# EAGLE design GPSPassive (EAGLE 7.4.0)
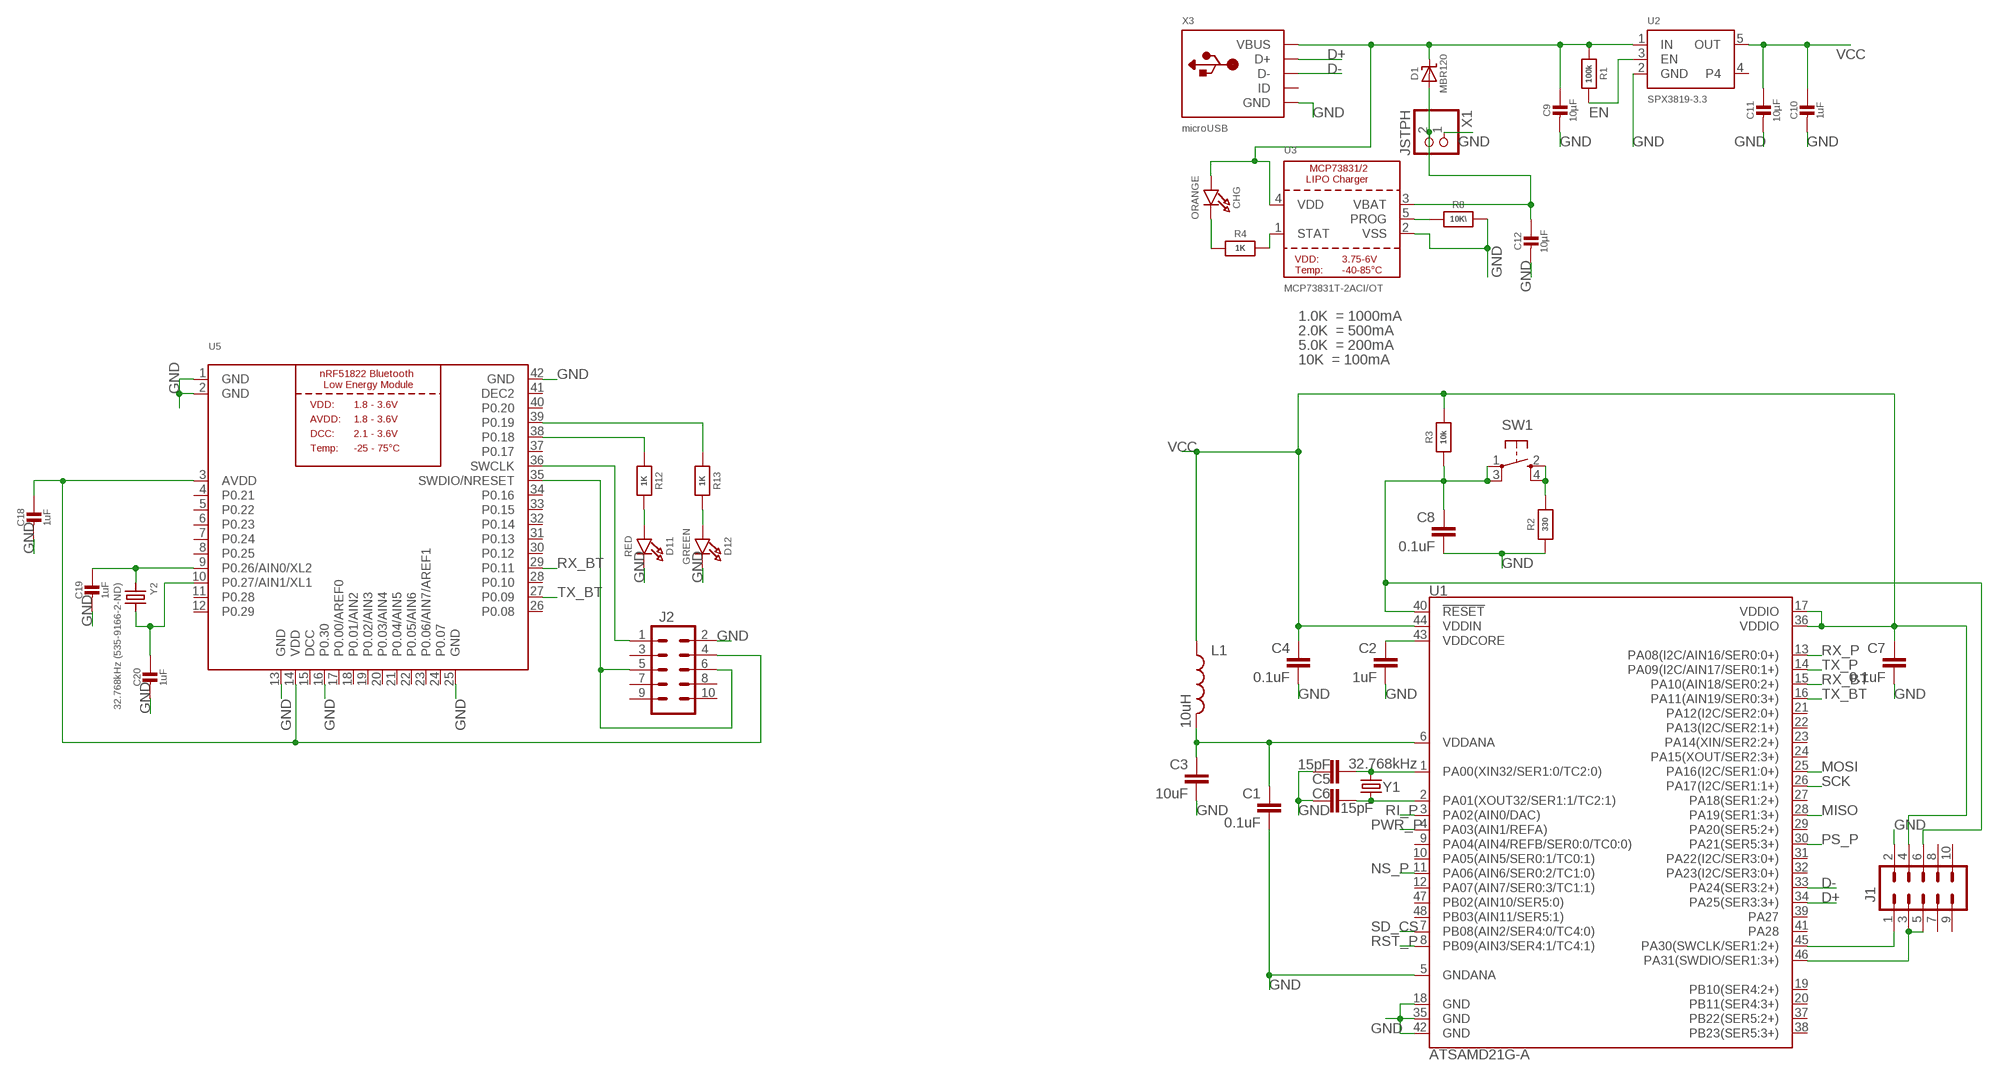
[diagram p0: schematic, sheet 1, part 1 of 2]
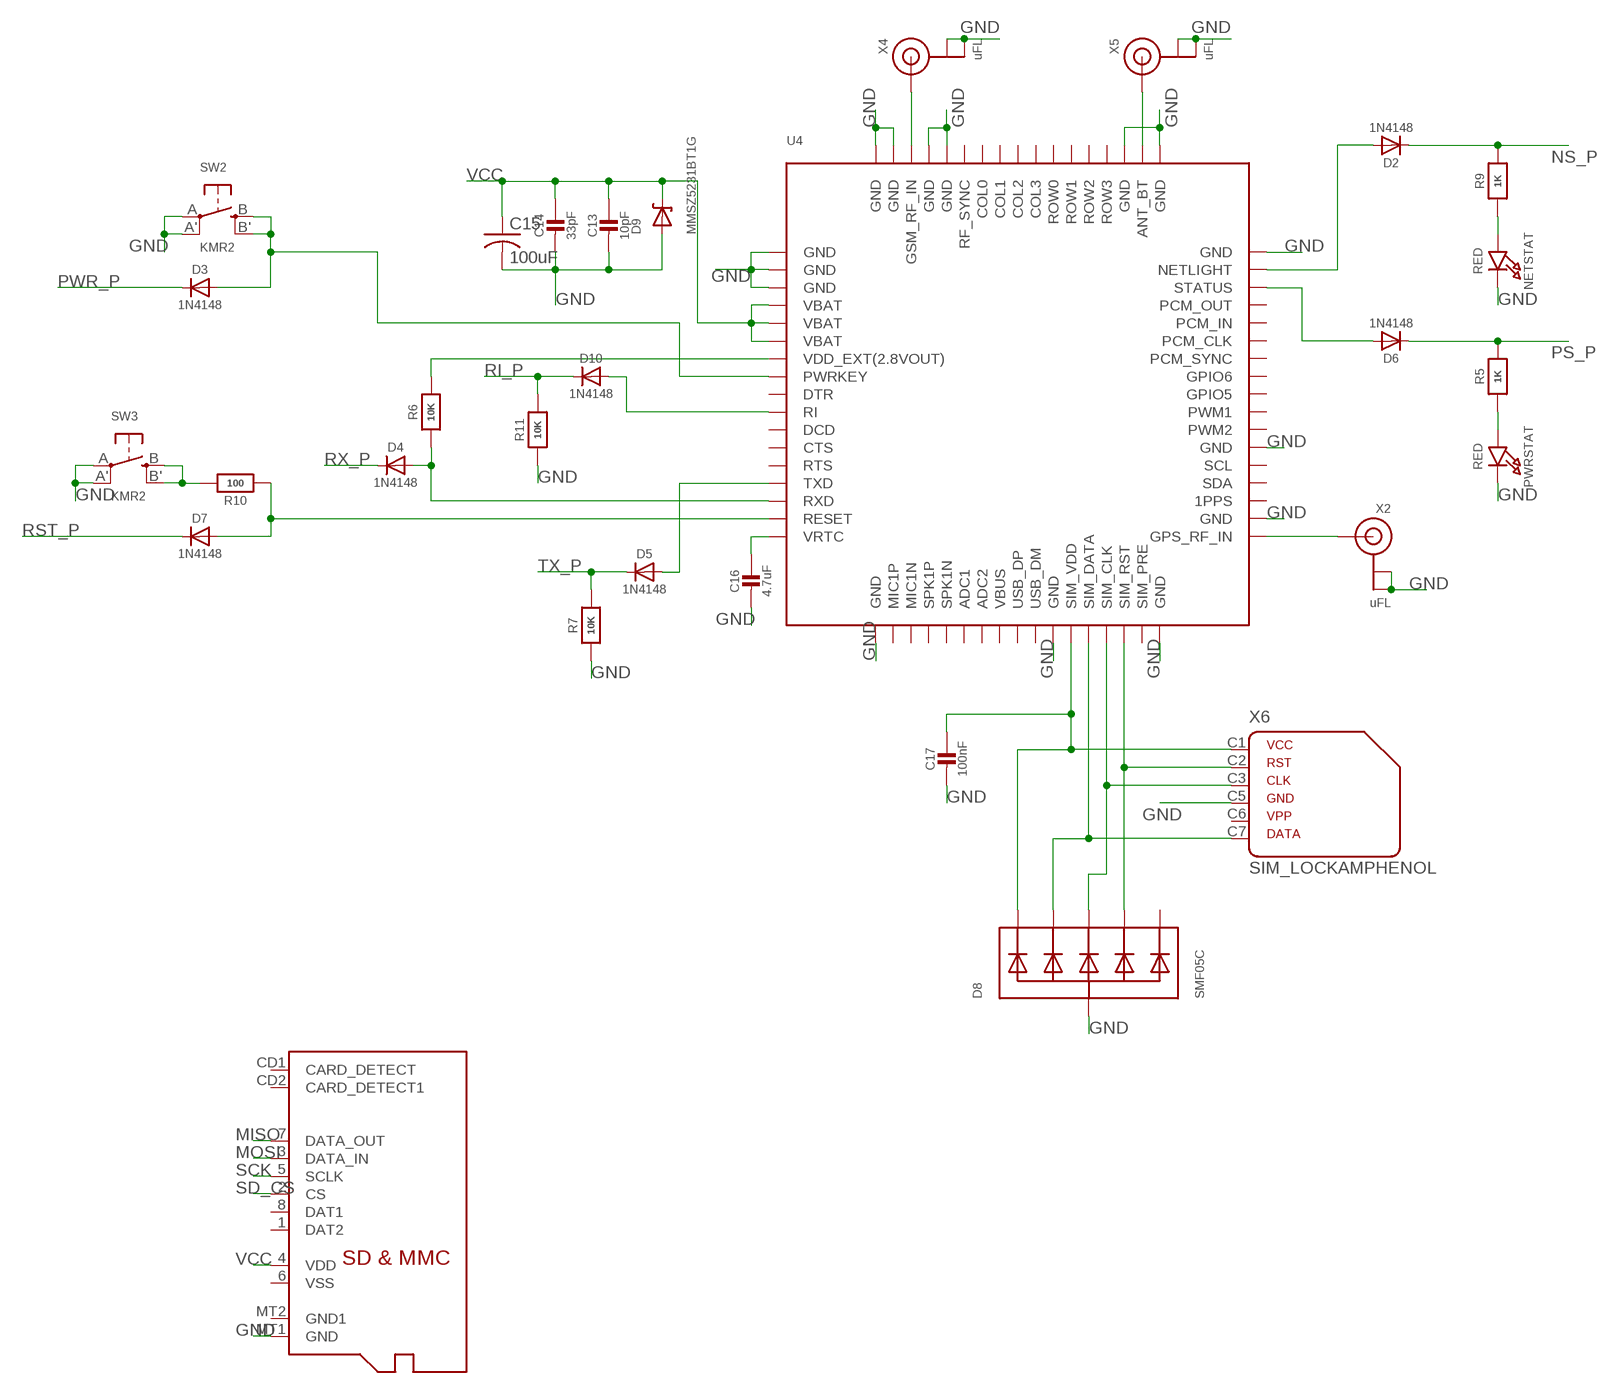
[diagram p1: schematic, sheet 1, part 2 of 2]

## Parts
C1  0.1uF  0.1UF-16V(+-10%)(0402)  [0402-CAP]
C2  1uF  0.1UF-16V(+-10%)(0402)  [0402-CAP]
C3  10uF  0.1UF-16V(+-10%)(0402)  [0402-CAP]
C4  0.1uF  0.1UF-16V(+-10%)(0402)  [0402-CAP]
C5  15pF  15PF-50V(+-5%)(0402)  [0402-CAP]
C6  15pF  15PF-50V(+-5%)(0402)  [0402-CAP]
C7  0.1uF  0.1UF-16V(+-10%)(0402)  [0402-CAP]
C8  0.1uF  0.1UF-16V(+-10%)(0402)  [0402-CAP]
C9  10µF  CAP_CERAMIC0805-NOOUTLINE  [0805-NO]
C10  1uF  CAP_CERAMIC0603_NO  [0603-NO]
C11  10µF  CAP_CERAMIC0805-NOOUTLINE  [0805-NO]
C12  10µF  CAP_CERAMIC0805-NOOUTLINE  [0805-NO]
C13  10pF  CAP_CERAMIC0805-NOOUTLINE  [0805-NO]
C14  33pF  CAP_CERAMIC0805-NOOUTLINE  [0805-NO]
C15  100uF  C-USC1210  [C1210]
C16  4.7uF  CAP_CERAMIC0805-NOOUTLINE  [0805-NO]
C17  100nF  CAP_CERAMIC0805-NOOUTLINE  [0805-NO]
C18  1uF  CAP_CERAMIC0805-NOOUTLINE  [0805-NO]
C19  1uF  CAP_CERAMIC0805-NOOUTLINE  [0805-NO]
C20  1uF  CAP_CERAMIC0805-NOOUTLINE  [0805-NO]
CHG  ORANGE  LED0805_NOOUTLINE  [CHIPLED_0805_NOOUTLINE]
D1  MBR120  DIODE-SCHOTTKYSOD-123  [SOD-123]
D2  1N4148  DIODESOD-323  [SOD-323]
D3  1N4148  DIODESOD-323  [SOD-323]
D4  1N4148  DIODESOD-323  [SOD-323]
D5  1N4148  DIODESOD-323  [SOD-323]
D6  1N4148  DIODESOD-323  [SOD-323]
D7  1N4148  DIODESOD-323  [SOD-323]
D8  SMF05C  TVSARRAY_5LANE  [SOT363]
D9  MMSZ5231BT1G  DIODE-ZENERSOD123  [SOD-123]
D10  1N4148  DIODESOD-323  [SOD-323]
D11  RED  LED0805_NOOUTLINE  [CHIPLED_0805_NOOUTLINE]
D12  GREEN  LED0805_NOOUTLINE  [CHIPLED_0805_NOOUTLINE]
J1  M05X2SHD_LOCK  [2X5-SHROUDED_LOCK]
J2  M05X2SHD_LOCK  [2X5-SHROUDED_LOCK]
L1  10uH  INDUCTOR0603  [0603]
NETSTAT  RED  LED0805_NOOUTLINE  [CHIPLED_0805_NOOUTLINE]
PWRSTAT  RED  LED0805_NOOUTLINE  [CHIPLED_0805_NOOUTLINE]
R1  100k  RESISTOR_0603_NOOUT  [0603-NO]
R2  330  RESISTOR_0603_NOOUT  [0603-NO]
R3  10k  RESISTOR_0603_NOOUT  [0603-NO]
R4  1K  RESISTOR_0603_NOOUT  [0603-NO]
R5  1K  RESISTOR0805_NOOUTLINE  [0805-NO]
R6  10K  RESISTOR0805_NOOUTLINE  [0805-NO]
R7  10K  RESISTOR0805_NOOUTLINE  [0805-NO]
R8  10K\  RESISTOR_0603_NOOUT  [0603-NO]
R9  1K  RESISTOR0805_NOOUTLINE  [0805-NO]
R10  100  RESISTOR0805_NOOUTLINE  [0805-NO]
R11  10K  RESISTOR0805_NOOUTLINE  [0805-NO]
R12  1K  RESISTOR0805_NOOUTLINE  [0805-NO]
R13  1K  RESISTOR0805_NOOUTLINE  [0805-NO]
SW1  SPST_TACT-KMR2  [KMR2]
SW2  KMR2  SWITCH_TACT_SMT4.6X2.8  [BTN_KMR2_4.6X2.8]
SW3  KMR2  SWITCH_TACT_SMT4.6X2.8  [BTN_KMR2_4.6X2.8]
U1  ATSAMD21G-A  [TQFP-48]
U2  SPX3819-3.3  VREG_SOT23-5  [SOT23-5]
U3  MCP73831T-2ACI/OT  MCP73831/2  [SOT23-5]
U4  GSM_SIM808_LITERAL  [SIM900_SMT]
U5  NRF51822_MODULE_MDBT40  [BLE_MODULE_RAYTAC_MDBT40]
U$1  MICROSD  [MICROSD]
X1  JSTPH  CON_JST_PH_2PIN  [JSTPH2]
X2  uFL  ANTENNA_U.FL  [U.FL]
X3  microUSB  USB_MICRO_20329_V2  [4UCONN_20329_V2]
X4  uFL  ANTENNA_U.FL  [U.FL]
X5  uFL  ANTENNA_U.FL  [U.FL]
X6  SIM_LOCKAMPHENOL  [C707_10M006_512_2]
Y1  32.768kHz  CRYSTAL3.2X1.5MM  [CRYSTAL-SMD-3.2X1.5MM]
Y2  32.768kHz (535-9166-2-ND)  CRYSTAL2.0X6.0_32.768  [CRYSTAL_CYL_2X6MM_SMT]

## Nets
!RESET: C8.1 J1.6 R3.1 SW1.1(P) SW1.3(P1) U1.40(!RESET!)
CONNECTED_LED: R13.1 U5.39(P0.19)
D+: U1.34(PA25(SER3:3+)) X3.D+
D-: U1.33(PA24(SER3:2+)) X3.D-
EN: R1.2 U2.3(EN)
GND: C1.2 C2.2 C3.2 C4.2 C5.1 C6.2 C7.2 C8.2 C9.2 C10.2 C11.2 C12.2 C13.2 C14.2 C15.2 C16.2 C17.2 C18.2 C19.2 C20.2 D8.2(A) D9.A D11.C D12.C J1.2 J2.2 NETSTAT.C PWRSTAT.C R2.1 R7.1 R8.2 R11.1 SW2.A'(P1) SW2.A(P) SW3.A'(P1) SW3.A(P) U1.5(GNDANA) U1.18(GND) U1.35(GND) U1.42(GND) U2.2(GND) U3.2(VSS) U4.P$1(GND) U4.P$2(GND) U4.P$3(GND) U4.P$18(GND) U4.P$28(GND) U4.P$34(GND) U4.P$36(GND) U4.P$40(GND) U4.P$51(GND) U4.P$52(GND) U4.P$54(GND) U4.P$64(GND) U4.P$65(GND) U4.P$67(GND) U4.P$68(GND) U5.1(GND) U5.2(GND) U5.13(GND) U5.16(P0.30) U5.25(GND) U5.42(GND) U$1.MT1(GND) X1.1 X2.1(GND) X2.2(GND) X3.BASE@1(GND) X3.BASE@2(GND) X3.GND X3.SPRT@1(GND) X3.SPRT@2(GND) X3.SPRT@3(GND) X3.SPRT@4(GND) X4.1(GND) X4.2(GND) X5.1(GND) X5.2(GND) X6.C5
MISO: U1.28(PA19(SER1:3+)) U$1.7(DATA_OUT)
MODE_LED: R12.1 U5.38(P0.18)
MOSI: U1.25(PA16(I2C/SER1:0+)) U$1.3(DATA_IN)
N$1: C2.1 U1.43(VDDCORE)
N$2: C5.2 U1.1(PA00(XIN32/SER1:0/TC2:0)) Y1.P$2
N$3: J1.1 U1.45(PA30(SWCLK/SER1:2+))
N$4: C6.1 U1.2(PA01(XOUT32/SER1:1/TC2:1)) Y1.P$1
N$5: J1.3 J1.5 U1.46(PA31(SWDIO/SER1:3+))
N$6: C16.1 U4.P$17(VRTC)
N$7: R2.2 SW1.2(S) SW1.4(S1)
N$8: R6.2 U4.P$7(VDD_EXT(2.8VOUT))
N$9: C12.1 D1.A U3.3(VBAT) X1.2
N$10: CHG.C R4.1
N$11: D4.A R6.1 U4.P$15(RXD)
N$12: R4.2 U3.1(STAT)
N$13: R8.1 U3.5(PROG)
N$14: C9.1 CHG.A D1.C R1.1 U2.1(IN) U3.4(VDD) X3.VBUS
N$15: D5.A U4.P$14(TXD)
N$16: D8.5(C4) U4.P$32(SIM_RST) X6.C2
N$17: D8.4(C3) U4.P$31(SIM_CLK) X6.C3
N$18: C17.1 D8.1(C1) U4.P$29(SIM_VDD) X6.C1
N$19: D8.3(C2) U4.P$30(SIM_DATA) X6.C7
N$20: NETSTAT.A R9.1
N$21: PWRSTAT.A R5.1
N$22: U4.P$66(GSM_RF_IN) X4.3(SIGNAL)
N$23: U4.P$35(GPS_RF_IN) X2.3(SIGNAL)
N$24: D10.A U4.P$10(RI)
N$25: U4.P$53(ANT_BT) X5.3(SIGNAL)
N$26: D11.A R12.2
N$27: D12.A R13.2
N$28: C19.1 U5.9(P0.26/AIN0/XL2) Y2.1
N$29: C20.1 U5.10(P0.27/AIN1/XL1) Y2.2
N$30: C18.1 J2.4 U5.3(AVDD) U5.14(VDD)
N$31: J2.1 U5.36(SWCLK)
N$32: J2.5 J2.6 U5.35(SWDIO/NRESET)
NS: D2.A U4.P$50(NETLIGHT)
NS_P: D2.C R9.2 U1.11(PA06(AIN6/SER0:2/TC1:0))
PS: D6.A U4.P$49(STATUS)
PS_P: D6.C R5.2 U1.30(PA21(SER5:3+))
PWR_P: D3.C U1.4(PA03(AIN1/REFA))
PWRKEY: D3.A SW2.B'(S1) SW2.B(S) U4.P$8(PWRKEY)
PWRKEY2: R10.2 SW3.B'(S1) SW3.B(S)
RI_P: D10.C R11.2 U1.3(PA02(AIN0/DAC))
RST: D7.A R10.1 U4.P$16(RESET)
RST_P: D7.C U1.8(PB09(AIN3/SER4:1/TC4:1))
RX_BT: U1.15(PA10(AIN18/SER0:2+)) U5.29(P0.11)
RX_P: D4.C U1.13(PA08(I2C/AIN16/SER0:0+))
SCK: U1.26(PA17(I2C/SER1:1+)) U$1.5(SCLK)
SD_CS: U1.7(PB08(AIN2/SER4:0/TC4:0)) U$1.2(CS)
TX_BT: U1.16(PA11(AIN19/SER0:3+)) U5.27(P0.09)
TX_P: D5.C R7.2 U1.14(PA09(I2C/AIN17/SER0:1+))
VCC: C4.1 C7.1 C10.1 C11.1 C13.1 C14.1 C15.1 D9.C J1.4 L1.1 R3.2 U1.17(VDDIO) U1.36(VDDIO) U1.44(VDDIN) U2.5(OUT) U4.P$4(VBAT) U4.P$5(VBAT) U4.P$6(VBAT) U$1.4(VDD)
VDDANA: C1.1 C3.1 L1.2 U1.6(VDDANA)
Unconnected: D8.6(C5) J1.7 J1.8 J1.9 J1.10 J2.3 J2.7 J2.8 J2.9 J2.10 U1.9(PA04(AIN4/REFB/SER0:0/TC0:0)) U1.10(PA05(AIN5/SER0:1/TC0:1)) U1.12(PA07(AIN7/SER0:3/TC1:1)) U1.19(PB10(SER4:2+)) U1.20(PB11(SER4:3+)) U1.21(PA12(I2C/SER2:0+)) U1.22(PA13(I2C/SER2:1+)) U1.23(PA14(XIN/SER2:2+)) U1.24(PA15(XOUT/SER2:3+)) U1.27(PA18(SER1:2+)) U1.29(PA20(SER5:2+)) U1.31(PA22(I2C/SER3:0+)) U1.32(PA23(I2C/SER3:0+)) U1.37(PB22(SER5:2+)) U1.38(PB23(SER5:3+)) U1.39(PA27) U1.41(PA28) U1.47(PB02(AIN10/SER5:0)) U1.48(PB03(AIN11/SER5:1)) U2.4 U4.P$9(DTR) U4.P$11(DCD) U4.P$12(CTS) U4.P$13(RTS) U4.P$19(MIC1P) U4.P$20(MIC1N) U4.P$21(SPK1P) U4.P$22(SPK1N) U4.P$23(ADC1) U4.P$24(ADC2) U4.P$26(USB_DP) U4.P$27(USB_DM) U4.P$33(SIM_PRE) U4.P$37(1PPS) U4.P$38(SDA) U4.P$39(SCL) U4.P$41(PWM2) U4.P$42(PWM1) U4.P$43(GPIO5) U4.P$44(GPIO6) U4.P$45(PCM_SYNC) U4.P$46(PCM_CLK) U4.P$47(PCM_IN) U4.P$48(PCM_OUT) U4.P$55(ROW3) U4.P$56(ROW2) U4.P$57(ROW1) U4.P$58(ROW0) U4.P$59(COL3) U4.P$60(COL2) U4.P$61(COL1) U4.P$62(COL0) U4.P$63(RF_SYNC) U5.4(P0.21) U5.5(P0.22) U5.6(P0.23) U5.7(P0.24) U5.8(P0.25) U5.11(P0.28) U5.12(P0.29) U5.17(P0.00/AREF0) U5.18(P0.01/AIN2) U5.19(P0.02/AIN3) U5.20(P0.03/AIN4) U5.21(P0.04/AIN5) U5.22(P0.05/AIN6) U5.23(P0.06/AIN7/AREF1) U5.24(P0.07) U5.26(P0.08) U5.28(P0.10) U5.30(P0.12) U5.31(P0.13) U5.32(P0.14) U5.33(P0.15) U5.34(P0.16) U5.37(P0.17) U5.40(P0.20) U$1.1(DAT2) U$1.6(VSS) U$1.8(DAT1) U$1.CD1(CARD_DETECT) U$1.CD2(CARD_DETECT1) U$1.MT2(GND1) X3.ID X6.C6

## Notes on the sheet
- 1.0K  = 1000mA
- 2.0K  = 500mA
- 5.0K  = 200mA
- 10K  = 100mA

## Power pins joined to a net without a drawn wire
DCC: U5.15(DCC)
DEC2: U5.41(DEC2)
VBUS: U4.P$25(VBUS)

## Library data of the parts
C1 C4 C7 C8 = SparkFun-Capacitors:0.1UF-16V(+-10%)(0402); PROD_ID: CAP-12416
C2 C3 = SparkFun-Capacitors:0.1UF-16V(+-10%)(0402); PROD_ID: CAP-12416; VALUE: 0.1uF
C5 C6 = samd21-temp:15PF-50V(+-5%)(0402); PROD_ID: CAP-13063
C9-C14 C16-C20 = microbuilder:CAP_CERAMIC: Ceramic Capacitors For new designs, use the packages preceded by an '_' character since they are more reliable: The following footprints should be used on most boards: _0402 - Standard footprint for regular board layouts _0603 - Standard footprint for regular board layouts _0805 - Standard footprint for regular board layouts _1206 - Standard footprint for regular board layouts For extremely tight-pitch boards where space is at a premium, the following 'micro-pitch' footprints can be used (smaller pads, no silkscreen outline, etc.): _0402MP - Micro-pitch footprint for very dense/compact boards _0603MP - Micro-pitch footprint for very dense/compact boards _0805MP - Micro-pitch footprint for very dense/compact boards _1206MP - Micro-pitch footprint for very dense/compact boards
C15 = rcl:C-US: CAPACITOR, American symbol
CHG D11 D12 NETSTAT PWRSTAT = microbuilder:LED: LED 0603 - 0603 Surface Mount Package 2mA: Green LED - Low Power (3.9mcd, 2ma, 1.7Vf) - Digikey: 475-2709-2-ND Orange LED - Low Power (9.8mcd, 2ma, 1.8Vf) - Digikey: 475-1194-2-ND Red LED - Low Power (5mcd, 2ma, 1.8Vf) - Digikey: 475-1195-2-ND Yellow LED - Low Power (7mcd, 2ma, 1.8Vf) - Digikey: 475-1196-2-ND 5mA: Blue LED - Low Power (17mcd, 5ma, 2.9Vf) - Digikey: LNJ937W8CRACT-ND 0805 - 0805 Surface Mount Package 2mA: Red LED (8.8mcd, 2mA, 1.8Vf, Clear) - Low Power [Digikey: 475-2510-1-ND] Green LED (5mcd, 2mA, 1.8Vf, Clear) - Low Power [Digikey: 475-2730-1-ND] Yellow LED (11.3mcd, 2mA, 1.8Vf, Clear) - Low Power [Digikey: 475-2555-1-ND] 20mA: Red LED (104mcd, 20mA, Diffused) - LS R976 [Digikey: 475-1278-6-ND] Red LED (12mcd, 20mA, 2.0Vf, Clear) - APT2012EC [Digikey: 754-1128-1-ND] Green LED (15mcd, 20mA, 2.2Vf, Clear) - APT2012GC [Digikey: 754-1131-1-ND] Orange LED (160mcd, 20mA, 2.1Vf, Clear) - APT2012SECK [Digikey: 754-1130-1-ND] 1206 - 1206 Surface Mount Package Green LED (26mcd, 20mA, Diffused) - LG N971 [Digikey: 475-1407-6-ND] Red LED (15mcd, 20mA, Diffused) - LH N974 [Digikey: 475-1416-6-ND] Cree - Cree High-Power Surface Mount LEDs XPEBWT-L1-0000-00D50 - White 111lm 350mA 2.9Vf 6200K 110° XTEAWT-00-0000-00000LEE3 - White 114lm 350mA 2.85Vf 5000K 115° Everlight - Everlight 45-21 Series Surface Mount LEDs 45-21/QK2C-B2832AC2CB2/2T - Warm White 2000mcd 20mA 3.25Vf 3050K 120° 45-21/LK2C-B38452C4CB2/2T - Nuetral White 2000mcd 20mA 3.25Vf 4150K 120° 45-21/LK2C-B50634C6CB2/2T - Cold White 2200mcd 20mA 3.25Vf 5650K 120° PLCC2 Reverse Mount LS T77K-J1L2-1-0-2-R18-Z - Red 11.25mcd 2mA 1.8Vf 630nm 120° LO T77K-L1M2-24-Z - Orange 19.6mcd 2mA 1.8Vf 606nm 120° LY T77K-K2M1-26-Z - Yellow 15.7mcd 2mA 1.8Vf 587nm 120°
D1 = microbuilder:DIODE-SCHOTTKY
D2-D7 D10 = microbuilder:DIODE: Diode SMA Model Volts Amps Type Vf Ir Digikey # Notes SSA34-E3 40V 3A Schottky 480mV @ 3A 200uA @ 40V SSA34-E3/61TGITR-ND CDBA120-G 20V 1A Schottky 500mV @ 1A 500uA @ 20V 641-1014-6-ND REEL MBRA210 10V 2A Schottky 350mV @ 2A 700uA @ 10V MBRA210LT3 SOD-123 Model Volts Amps Type Vf Ir Order # Notes BAT54T1G 30V 200mA Schottky 800mV @ 200mA 2uA @ 25V BAT54T1GOSTR-ND B0530W 30V 500mA Schottky 430mV @ 500mA 130uA @ 30V B0530W-FDICT-ND REEL MBR120 20V 1A Schottky 340mV @ 1A MBR120VLSFT1GOSCT-ND SOD-323 Model Volts Amps Type Vf Ir Order # Notes PMEG2005EJ 20V 500mA Schottky 355mV @ 500mA 568-4110-1-ND ZLLS410 10V 570mA Schottky 380mV @ 570mA ZLLS410CT-ND 1N4148WS 75V 150mA Silicon/Simple 1V 1N4148WSFSCT-ND REEL SOD-523 Model Volts Amps Type Vf Ir Order # Notes BAT54XV2 30V 200mA Schottky 0.8V @ 100mA BAT54XV2CT-ND TB751S 30V 30mA Schottky RB751S-40TE61CT-ND SOT23-R/W (R = Solder Paste/Reflow Ovens, W = Hand-Soldering) Model Volts Amps Type Vf Ir Order # Notes BAT54FILM 40V 300mA Schottky 497-7162-1-ND POWERDI-5 Model Volts Amps Type Vf Ir Order # Notes PDS560 60V 5A Schottky 670mV @ 5A 150uA @ 60V PDS560DICT-ND
D8 = microbuilder:TVSARRAY_5LANE: Voltage Transient Suppressor Array SOT363 SMF05C - 100W 5V: Digikey - SMF05CT1GOSCT-ND
D9 = microbuilder:DIODE-ZENER: Zener Diode SMA: 30V 1W Zener Diode, 1.2Vf - Digikey: SMAZ30-FDICT-ND
J1 J2 = SparkFun-Connectors:M05X2: Header 5x2 Standard 10-pin dual row 0.1" header. Commonly used with AVR-ISP. Use with Spark Fun Electronics SKU: PRT-00778
L1 = SparkFun-Passives:INDUCTOR: Inductors Basic Inductor/Choke - 0603 and 1206. Footprints are not proven and vary greatly between part numbers. INDUCTOR POWER 3.3UH 4.0A SMD 0.197" L x 0.197" W x 0.177" H (5.00mm x 5.00mm x 4.50mm); PROD_ID: RES-07859
R1-R13 = microbuilder:RESISTOR: Resistors For new designs, use the packages preceded by an '_' character since they are more reliable: The following footprints should be used on most boards: _0402 - Standard footprint for regular board layouts _0603 - Standard footprint for regular board layouts _0805 - Standard footprint for regular board layouts _1206 - Standard footprint for regular board layouts For extremely tight-pitch boards where space is at a premium, the following 'micro-pitch' footprints can be used (smaller pads, no silkscreen outline, etc.): _0402MP - Micro-pitch footprint for very dense/compact boards _0603MP - Micro-pitch footprint for very dense/compact boards _0805MP - Micro-pitch footprint for very dense/compact boards _1206MP - Micro-pitch footprint for very dense/compact boards
SW1 = adafruit:SPST_TACT: SMT 6mm switch, EVQQ2 series http://www.ladyada.net/library/eagle
SW2 SW3 = microbuilder:SWITCH_TACT_SMT: SMT Tact Switches 6x6mm - Digikey: P12940SCT-ND KMR2 (4.6x2.8mm) - Digikey: 401-1426-1-ND EVQ-PQHB55 - Light Touch, 160GF (4.5x4.5mm) - Digikey: P8090SCT-ND KMT0 - KMT021 NGJ LHS (etc.) IP68/Waterproof - Digikey: CKN10289CT-ND
U1 = SparkFun-DigitalIC:ATSAMD21G: Atmel SAMD21G SMART ARM-Based Microcontroller The Atmel ® | SMART ™ SAM D21 is a series of low-power microcontrollers using the 32-bit ARM ® Cortex ® -M0+ processor, and ranging from 32- to 64-pins with up to 256KB Flash and 32KB of SRAM. The SAM D21 devices operate at a maximum frequency of 48MHz and reach 2.46 CoreMark/MHz. They are designed for simple and intuitive migration with identical peripheral modules, hex compatible code, identical linear address map and pin compatible migration paths between all devices in the product series. All devices include intelligent and flexible peripherals, Atmel Event System for inter-peripheral signaling, and support for capacitive touch button, slider and wheel user interfaces.; PROD_ID: IC-13064
U2 = microbuilder:VREG_SOT23-5: SOT23-5 Fixed Voltage Regulators Part Current Out V Out V In V Dropout θJA (°C/W) TJ (°C) Digikey Part No. ADP121 150mA 3.3V 3.4-5.5V 0.09V @ 150mA -- -- ADP121-AUJZ33R7CT-ND ADP121 150mA 3.0V 3.1-5.5V 0.09V @ 150mA -- -- ADP121-AUJZ30R7CT-ND ADP122 300mA 3.3V 3.4-5.5V 0.085V @ 300mA -- -- ADP122AUJZ-3.3-R7CT-ND ADP1712 300mA 3.3V 3.5-5.5V 0.17V @ 300mA -- -- ADP1712AUJZ-3.3-R7TR-ND AP7311 (Low Cost) 150mA 3.3V 3.5-6V 0.15V @ 150mA -- -- AP7311-33WG-7DICT-ND LD39015M18R 150mA 1.8V 1.9V-5.5V 0.08V @ 100mA -- -- 497-6977-1-ND LP2985A-33DBVR 150mA 3.3V 3.3-16V 0.28V @ 150mA 206 150 296-18479-1-ND MCP1824T-3302E/OT 300mA 3.3V 3.5V-6V 0.2V @ 300mA -- -- MCP1824T-3302E/OTCT-ND MIC5205-2.5YM5 TR 150mA 2.5V 2.7-16V 0.165V @ 150mA -- -- 576-1257-2-ND MIC5205-3.0YM5 TR 150mA 3.0V 3.2V-16V 0.165V @ 150mA -- -- 576-1258-2-ND MIC5205-3.3YM5 TR 150mA 3.3V 3.5V-16V 0.165V @ 150mA -- -- 576-1259-2-ND TPS780330220 150mA 3.3V+2.2V 3.6-5.5V 250mV Max -- -- 296-23332-1-ND TDA3663/N1,135 100mA 3.3V 3.5-45V 0.18V @ 50mA -- -- 568-5343-1-ND Max operating temp can be calculated using θJA, TJ (max junction temperature), and power in watts. Set the "Maximum Ambient Temperature" until it reaches TJ ("Max Junction Temperature"), which is the absolute limit for safe use of the regulator: Heat Sink Temperature Calculator <http://www.daycounter.com/Calculators/Heat-Sink-Temperature-Calculator.phtml> For example, With 12V source into a 3.3V LP2985 and a 30mA load, we are dissipating (12V-3.3V) * 0.03A = 0.261W. With a θJA of 206 °C/W, a TJ of 150°C, and 261mW we can safely use the chip without a heat sink up to 75°C (=147.1°C Junction Temperature).
U3 = microbuilder:MCP73831/2: MCP73831/2 LIPO Charger VDD: 3.75 - 6V Temp -40 - 85°C Programmable Charge Rate: 15-500mA NOTE: STAT is a tri-state logic output on the MCP73831 and an open-drain output on the MCP73832. SOT23-5 with 4.2V output and tri-state logic on STAT = MCP73831T-2ACI/OT
U4 = adafruit:GSM_SIM808_LITERAL: SIM808 GSM Module
U5 = microbuilder:NRF51822_MODULE_MDBT40: nRF51822 Bluetooth Low Energy Module
U$1 = adafruit:MICROSD: Micro-SD / Transflash card holder with SPI pinout For the 3M # 2908-05WB-MG and/or 4UCON #19656 push-push type
X1 = microbuilder:CON_JST_PH_2PIN: JST 2-Pin Right-Angle Connector PH-Series - 4UConnector: 17311 SH-Series - 4UConnector: 07278
X2 X4 X5 = microbuilder:ANTENNA_U.FL: U.FL Antenna Connector
X3 = microbuilder:USB: USB Connectors USBMINIB - Surface Mount Female Mini-B USB Connector 4UConnector: 06564
X6 = microbuilder:SIM_LOCK: C707A SIMLOCK® 2.5 mm with wide solder tails Source: Data sheet <http://www.amphenol.info/downloads/C707_10M006_512_2.pdf>; OC_FARNELL: unknown; OC_NEWARK: unknown
Y1 = samd21-temp:CRYSTAL: Various standard crystals. Proven footprints.; PROD_ID: XTAL-13062
Y2 = microbuilder:CRYSTAL: Crystals HC49UP - Surface Mount Crystal 4.0MHz 18pF +/-30ppm Surface Mount Crystal [Digikey: 535-9857-1-ND] 12.0 MHz Surface Mount Crystal [Digikey: 535-9869-6-ND] 25.0 MHz Surface Mount Crystal [Digikey: 535-9078-1-ND] 2.5 x 2.0mm - MEMs SMT Crystal 16.0 MHz 10pF 20ppm 2.5 x 2.0mm Crystal [Digikey -40-85°C: 535-10923-1-ND] 3.2 x 2.5mm - MEMs SMT Crystal 12.0 MHz 8pF 15ppm 3.2 x 2.5mm Crystal [Digikey: -10-70°C: 644-1047-1-ND -40-125°C: 644-1128-1-ND] 40~85°C cheaper: 644-1173-6-ND 16.0 MHz 8pF 15ppm 3.2 x 2.5mm Crystal [Digikey: -10-70°C: 644-1049-1-ND -40-125°C: 644-1129-2-ND]-40~85°C cheaper: 644-1175-6-ND 16.0 MHz 10pF 10ppm 3.2 x 2.5mm Crystal [Digikey: 644-1100-1-ND] 27.12 MHz 18pF 30ppm 3.2 x 2.5mm Crystal [Digikey: 887-1424-1-ND] 27.12MHz 10pF 10ppm 3.2 x 2.5mm Crystal [Digikey: 887-1329-1-ND] 4.9 x 1.8mm - MEMs SMT Crystal 32.768 KHz 12.5pF 20ppm 4.9 x 1.8mm Crystal [Digikey: SE2415CT-ND] 8.0 x 3.8mm - Surface Mount Crystal 32.768kHz 12.5pF 20ppm -40°C-85°C [Digikey: 535-9166-2-ND] Cylinder 32.768KHz Cylinder Crystal (2x6mm body) [Ex. Digikey: 300-8341-2-ND]

## Board
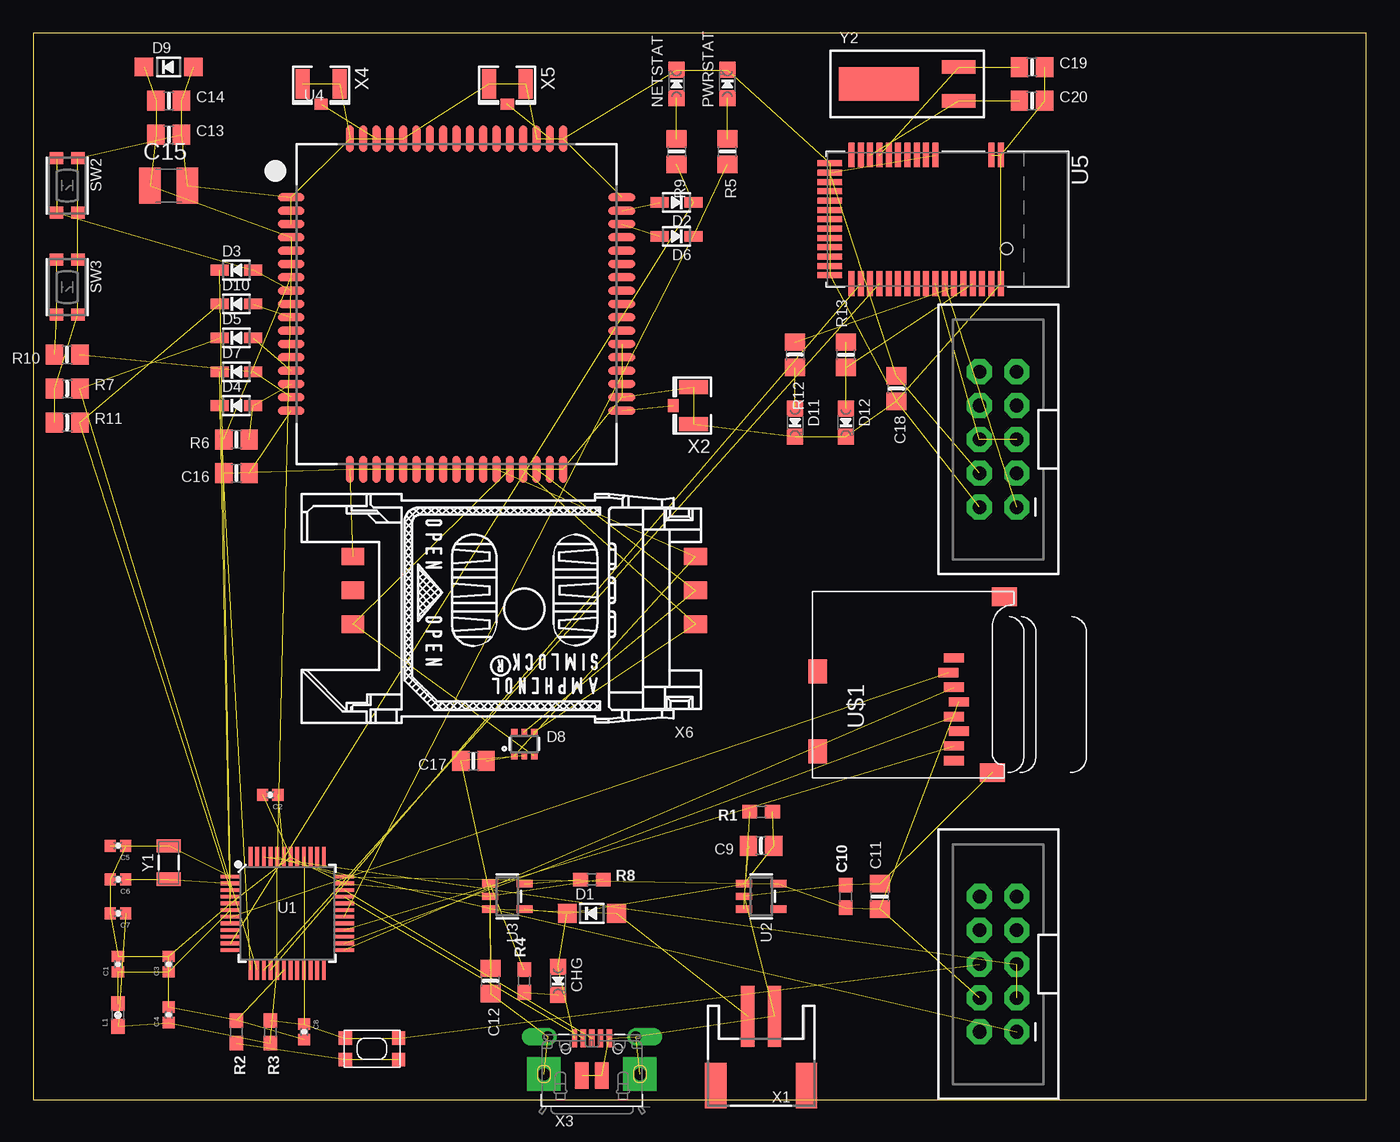
[diagram p2: board, top side]
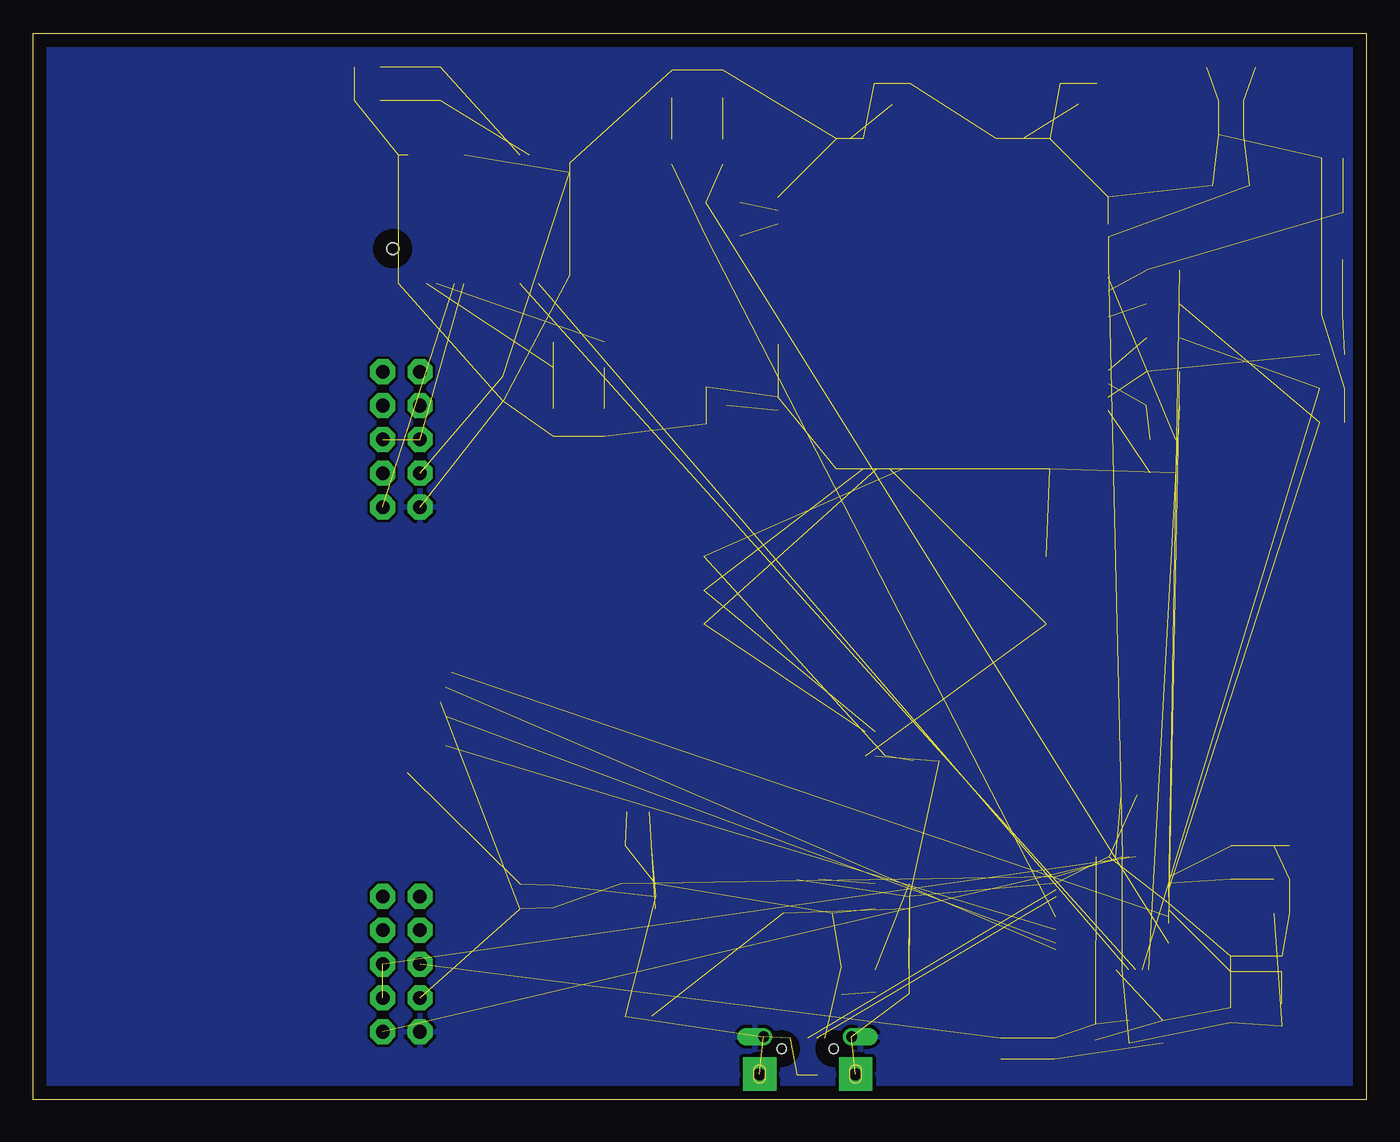
[diagram p3: board, bottom side, seen from below]

Size 100 x 80 mm. Coordinates in mm from the lower left corner, seen from the top.
Outline: 0,0 100,0 100,80 0,80 0,0
Copper layers (1*16): Top 0.035mm / dielectric 1.5mm / Bottom 0.035mm
Design rules "default": minimum track width 10mil, minimum drill 24mil, track to track 8mil, track to pad 8mil, pad to pad 8mil, via to via 8mil, smd to smd 8mil, copper to edge 40mil, drill to drill 8mil, minimum pad ring 10mil, minimum via ring 8mil, stop-mask expansion 4mil, vias tented up to drill 0mil, thermal gap 10mil

### Footprints (pad centres in the part's own frame; a part is rotated, then mirrored left to right if it is on the bottom)
0402-CAP = smd 0.85 x 0.9: 1 -0.58,0; 2 0.58,0
0805-NO = smd 1.3 x 1.5: 1 -0.95,0; 2 0.95,0
0603-NO = smd 1.1 x 1: 1 -0.85,0; 2 0.85,0
C1210 = smd 1.6 x 2.7: 1 -1.4,0; 2 1.4,0
CHIPLED_0805_NOOUTLINE = smd 1.2 x 1.2: A 0,-1.05; C 0,1.05
SOD-123 = smd 1.4 x 1.4: A 1.85,0; C -1.85,0
SOD-323 = smd 1.35 x 0.8: A 1.27,0; C -1.27,0
SOT363 = smd 0.5 x 0.5: 1 -0.75,-0.9; 3 0.75,-0.9; 4 0.75,0.9; 6 -0.75,0.9 | smd 0.4 x 0.5: 2 0,-0.9; 5 0,0.9
2X5-SHROUDED_LOCK = drill 1.016 pad 1.88 octagon: 1 -1.397,5.08; 2 1.397,5.08; 3 -1.397,2.54; 4 1.397,2.54; 5 -1.397,0; 6 1.397,0; 7 -1.397,-2.54; 8 1.397,-2.54; 9 -1.397,-5.08; 10 1.397,-5.08
0603 = smd 1.1 x 1: 1 -0.85,0; 2 0.85,0
KMR2 = smd 1 x 1: 1 2,0.8; 2 2,-0.8; 3 -2,0.8; 4 -2,-0.8
BTN_KMR2_4.6X2.8 = smd 0.9 x 1: A 2.05,0.8; A' -2.05,0.8; B 2.05,-0.8; B' -2.05,-0.8
TQFP-48 = smd 1.5 x 0.28: 1 -4.25,2.75; 2 -4.25,2.25; 3 -4.25,1.75; 4 -4.25,1.25; 5 -4.25,0.75; 6 -4.25,0.25; 7 -4.25,-0.25; 8 -4.25,-0.75; 9 -4.25,-1.25; 10 -4.25,-1.75; 11 -4.25,-2.25; 12 -4.25,-2.75; 25 4.25,-2.75; 26 4.25,-2.25; 27 4.25,-1.75; 28 4.25,-1.25; 29 4.25,-0.75; 30 4.25,-0.25; 31 4.25,0.25; 32 4.25,0.75; 33 4.25,1.25; 34 4.25,1.75; 35 4.25,2.25; 36 4.25,2.75 | smd 0.28 x 1.5: 13 -2.75,-4.25; 14 -2.25,-4.25; 15 -1.75,-4.25; 16 -1.25,-4.25; 17 -0.75,-4.25; 18 -0.25,-4.25; 19 0.25,-4.25; 20 0.75,-4.25; 21 1.25,-4.25; 22 1.75,-4.25; 23 2.25,-4.25; 24 2.75,-4.25; 37 2.75,4.25; 38 2.25,4.25; 39 1.75,4.25; 40 1.25,4.25; 41 0.75,4.25; 42 0.25,4.25; 43 -0.25,4.25; 44 -0.75,4.25; 45 -1.25,4.25; 46 -1.75,4.25; 47 -2.25,4.25; 48 -2.75,4.25
SOT23-5 = smd 0.55 x 1.2: 1 -0.95,-1.3; 2 0,-1.3; 3 0.95,-1.3; 4 0.95,1.3; 5 -0.95,1.3
SIM900_SMT = smd 2 x 0.6: P$1 -12.4,8; P$2 -12.4,7; P$3 -12.4,6; P$4 -12.4,5; P$5 -12.4,4; P$6 -12.4,3; P$7 -12.4,2; P$8 -12.4,1; P$9 -12.4,0; P$10 -12.4,-1; P$11 -12.4,-2; P$12 -12.4,-3; P$13 -12.4,-4; P$14 -12.4,-5; P$15 -12.4,-6; P$16 -12.4,-7; P$17 -12.4,-8; P$35 12.4,-8; P$36 12.4,-7; P$37 12.4,-6; P$38 12.4,-5; P$39 12.4,-4; P$40 12.4,-3; P$41 12.4,-2; P$42 12.4,-1; P$43 12.4,0; P$44 12.4,1; P$45 12.4,2; P$46 12.4,3; P$47 12.4,4; P$48 12.4,5; P$49 12.4,6; P$50 12.4,7; P$51 12.4,8 | smd 0.6 x 2: P$18 -8,-12.4; P$19 -7,-12.4; P$20 -6,-12.4; P$21 -5,-12.4; P$22 -4,-12.4; P$23 -3,-12.4; P$24 -2,-12.4; P$25 -1,-12.4; P$26 0,-12.4; P$27 1,-12.4; P$28 2,-12.4; P$29 3,-12.4; P$30 4,-12.4; P$31 5,-12.4; P$32 6,-12.4; P$33 7,-12.4; P$34 8,-12.4; P$52 8,12.4; P$53 7,12.4; P$54 6,12.4; P$55 5,12.4; P$56 4,12.4; P$57 3,12.4; P$58 2,12.4; P$59 1,12.4; P$60 0,12.4; P$61 -1,12.4; P$62 -2,12.4; P$63 -3,12.4; P$64 -4,12.4; P$65 -5,12.4; P$66 -6,12.4; P$67 -7,12.4; P$68 -8,12.4
BLE_MODULE_RAYTAC_MDBT40 = smd 1.85 x 0.45: 1 -4.825,4; 2 -4.825,3.3; 3 -4.825,-0.9; 4 -4.825,-1.6; 5 -4.825,-2.3; 6 -4.825,-3; 7 -4.825,-3.7; 8 -4.825,-4.4; 9 -4.825,-5.1; 10 -4.825,-5.8; 11 -4.825,-6.5; 12 -4.825,-7.2; 26 4.825,-7.2; 27 4.825,-6.5; 28 4.825,-5.8; 29 4.825,-5.1; 30 4.825,-4.4; 31 4.825,-3.7; 32 4.825,-3; 33 4.825,-2.3; 34 4.825,-1.6; 35 4.825,-0.9; 36 4.825,-0.2; 37 4.825,0.5; 38 4.825,1.2; 39 4.825,1.9; 40 4.825,2.6; 41 4.825,3.3; 42 4.825,4 | smd 0.45 x 1.85: 13 -4.2,-8.825; 14 -3.5,-8.825; 15 -2.8,-8.825; 16 -2.1,-8.825; 17 -1.4,-8.825; 18 -0.7,-8.825; 19 0,-8.825; 20 0.7,-8.825; 21 1.4,-8.825; 22 2.1,-8.825; 23 2.8,-8.825; 24 3.5,-8.825; 25 4.2,-8.825 | hole 0.9: 2.2,4.45
MICROSD = smd 0.7 x 1.5: 1 9,-10.64; 2 7.9,-10.24; 3 6.8,-10.64; 4 5.7,-11.04; 5 4.6,-10.64; 6 3.5,-11.04; 7 2.4,-10.64; 8 1.3,-10.64 | smd 1.8 x 1.4: CD1 2,-0.44; CD2 8,-0.44 | smd 1.4 x 1.9: MT1 0.4,-13.54; MT2 13.6,-14.44
JSTPH2 = smd 1 x 4.6: 1 -1,-3.7; 2 1,-3.7 | smd 1.6 x 3.4: NC1 -3.4,1.5; NC2 3.4,1.5
U.FL = smd 2.2 x 1.05: 1 0,1.375; 2 0,-1.375 | smd 0.8 x 1: 3 1.525,0
4UCONN_20329_V2 = smd 1 x 2: BASE@1 -0.75,-2; BASE@2 0.75,-2 | smd 0.4 x 1.35: D+ 0,0.775; D- -0.65,0.775; GND 1.3,0.775; ID 0.65,0.775; VBUS -1.3,0.775 | drill 0.8 pad 1.2 offset: SPRT@1 -3.3,0.9; SPRT@2 3.3,0.9 | drill 0.9 pad 2.5 square: SPRT@3 -3.6,-1.9; SPRT@4 3.6,-1.9 | hole 0.7: -1.95,0; 1.95,0
C707_10M006_512_2 = smd 1.7 x 1.3: C1 -12.85,-3.915; C2 -12.85,-1.375; C3 -12.85,1.165; C5 12.85,-3.915; C6 12.85,-1.375; C7 12.85,1.165
CRYSTAL-SMD-3.2X1.5MM = smd 1 x 1.8: P$1 -1.25,0; P$2 1.25,0
CRYSTAL_CYL_2X6MM_SMT = smd 2.5 x 1: 1 2.125,1.27; 2 2.125,-1.27 | smd 6 x 2.5: CYLINDER -3.875,0

### Placement (x,y rotation side)
C1  6.35,10.16 90 top
C2  17.78,22.86 180 top
C3  10.16,10.16 90 top
C4  10.16,6.35 90 top
C5  6.35,19.05 180 top
C6  6.35,16.51 180 top
C7  6.35,13.97 180 top
C8  20.32,5.08 270 top
C9  54.61,19.05 180 top
C10  60.96,15.24 90 top
C11  63.5,15.24 90 top
C12  34.29,8.89 270 top
C13  10.16,72.39 0 top
C14  10.16,74.93 0 top
C15  10.16,68.58 0 top
C16  15.24,46.99 180 top
C17  33.02,25.4 180 top
C18  64.77,53.34 270 top
C19  74.93,77.47 0 top
C20  74.93,74.93 0 top
CHG  39.37,8.89 180 top
D1  41.91,13.97 0 top
D2  48.26,67.31 180 top
D3  15.24,62.23 0 top
D4  15.24,52.07 0 top
D5  15.24,57.15 0 top
D6  48.26,64.77 180 top
D7  15.24,54.61 0 top
D8  36.83,26.67 0 top
D9  10.16,77.47 0 top
D10  15.24,59.69 0 top
D11  57.15,50.8 180 top
D12  60.96,50.8 180 top
J1  72.39,10.16 180 top
J2  72.39,49.53 180 top
L1  6.35,6.35 90 top
NETSTAT  48.26,76.2 0 top
PWRSTAT  52.07,76.2 0 top
R1  54.61,21.59 180 top
R2  15.24,5.08 270 top
R3  17.78,5.08 270 top
R4  36.83,8.89 90 top
R5  52.07,71.12 270 top
R6  15.24,49.53 180 top
R7  2.54,53.34 0 top
R8  41.91,16.51 0 top
R9  48.26,71.12 270 top
R10  2.54,55.88 180 top
R11  2.54,50.8 0 top
R12  57.15,55.88 270 top
R13  60.96,55.88 90 top
SW1  25.4,3.81 0 top
SW2  2.54,68.58 270 top
SW3  2.54,60.96 270 top
U1  19.05,13.97 0 top
U2  54.61,15.24 270 top
U3  35.56,15.24 270 top
U4  31.75,59.69 0 top
U5  68.58,66.04 270 top
U$1  58.42,24.13 90 top
X1  54.61,2.54 180 top
X2  49.53,52.07 180 top
X3  41.91,3.81 0 top
X4  21.59,76.2 270 top
X5  35.56,76.2 270 top
X6  36.83,36.83 180 top
Y1  10.16,17.78 90 top
Y2  67.31,76.2 0 top

### Tracks (layer width: path | path; a pad name or v marks a point on that pad's centre or on a via)
!RESET  (5 unrouted)
CONNECTED_LED  (1 unrouted)
D+  (1 unrouted)
D-  (1 unrouted)
EN  (1 unrouted)
GND  (75 unrouted)
  pour Bottom: 0,-1.27 101.6,-1.27 101.6,1.27 101.6,82.55 0,82.55
MISO  (1 unrouted)
MODE_LED  (1 unrouted)
MOSI  (1 unrouted)
N$1  (1 unrouted)
N$2  (2 unrouted)
N$3  (1 unrouted)
N$4  (2 unrouted)
N$5  (2 unrouted)
N$6  (1 unrouted)
N$7  (2 unrouted)
N$8  (1 unrouted)
N$9  (3 unrouted)
N$10  (1 unrouted)
N$11  (2 unrouted)
N$12  (1 unrouted)
N$13  (1 unrouted)
N$14  (6 unrouted)
N$15  (1 unrouted)
N$16  (2 unrouted)
N$17  (2 unrouted)
N$18  (3 unrouted)
N$19  (2 unrouted)
N$20  (1 unrouted)
N$21  (1 unrouted)
N$22  (1 unrouted)
N$23  (1 unrouted)
N$24  (1 unrouted)
N$25  (1 unrouted)
N$26  (1 unrouted)
N$27  (1 unrouted)
N$28  (2 unrouted)
N$29  (2 unrouted)
N$30  (3 unrouted)
N$31  (1 unrouted)
N$32  (2 unrouted)
NS  (1 unrouted)
NS_P  (2 unrouted)
PS  (1 unrouted)
PS_P  (2 unrouted)
PWR_P  (1 unrouted)
PWRKEY  (3 unrouted)
PWRKEY2  (2 unrouted)
RI_P  (2 unrouted)
RST  (2 unrouted)
RST_P  (1 unrouted)
RX_BT  (1 unrouted)
RX_P  (1 unrouted)
SCK  (1 unrouted)
SD_CS  (1 unrouted)
TX_BT  (1 unrouted)
TX_P  (2 unrouted)
VCC  (18 unrouted)
VDDANA  (3 unrouted)